# EAGLE schematic myBusToUEXT (EAGLE 7.3.0)
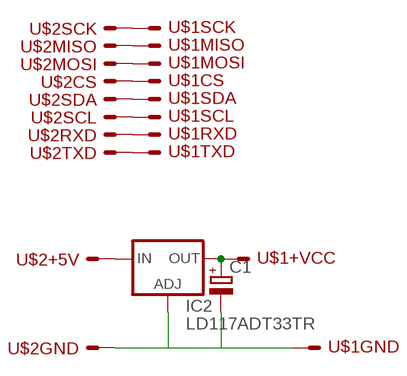
[diagram p0: schematic, sheet 1]

## Parts
C1  CPOL-EUE2.5-5  [E2,5-5]
IC2  LD117ADT33TR  [DPACK]
U$1  SPI_BUS2  [SPI_BUS2]
U$2  SPI_BUS  [SPI_BUS]

## Nets
N$1: U$1.TXD U$2.TXD
N$2: U$1.MOSI U$2.MOSI
N$3: U$1.MISO U$2.MISO
N$4: U$1.SCK U$2.SCK
N$5: U$1.CS U$2.CS
N$6: U$1.INT/SDA U$2.SDA
N$7: U$1.RST/SCL U$2.SCL
N$8: U$1.GPIO/RXD U$2.RXD
N$9: C1.- IC2.1(ADJ) U$1.GND U$2.GND
N$10: C1.+ IC2.4(OUT) U$1.+VCC
N$11: IC2.3(IN) U$2.+5V

## Library data of the parts
C1 = rcl:CPOL-EU: POLARIZED CAPACITOR, European symbol
IC2 = v-reg:LD117A?*: Low drop fixed and adjustable positive voltage regulators 1 A Source: http://www.st.com/stonline/products/literature/ds/7194/ld1117axx.pdf
U$1 = lieven:SPI_BUS2
U$2 = lieven:SPI_BUS